# Altium project Engineering_project_main_board.PrjPcb (part 1 of 2)
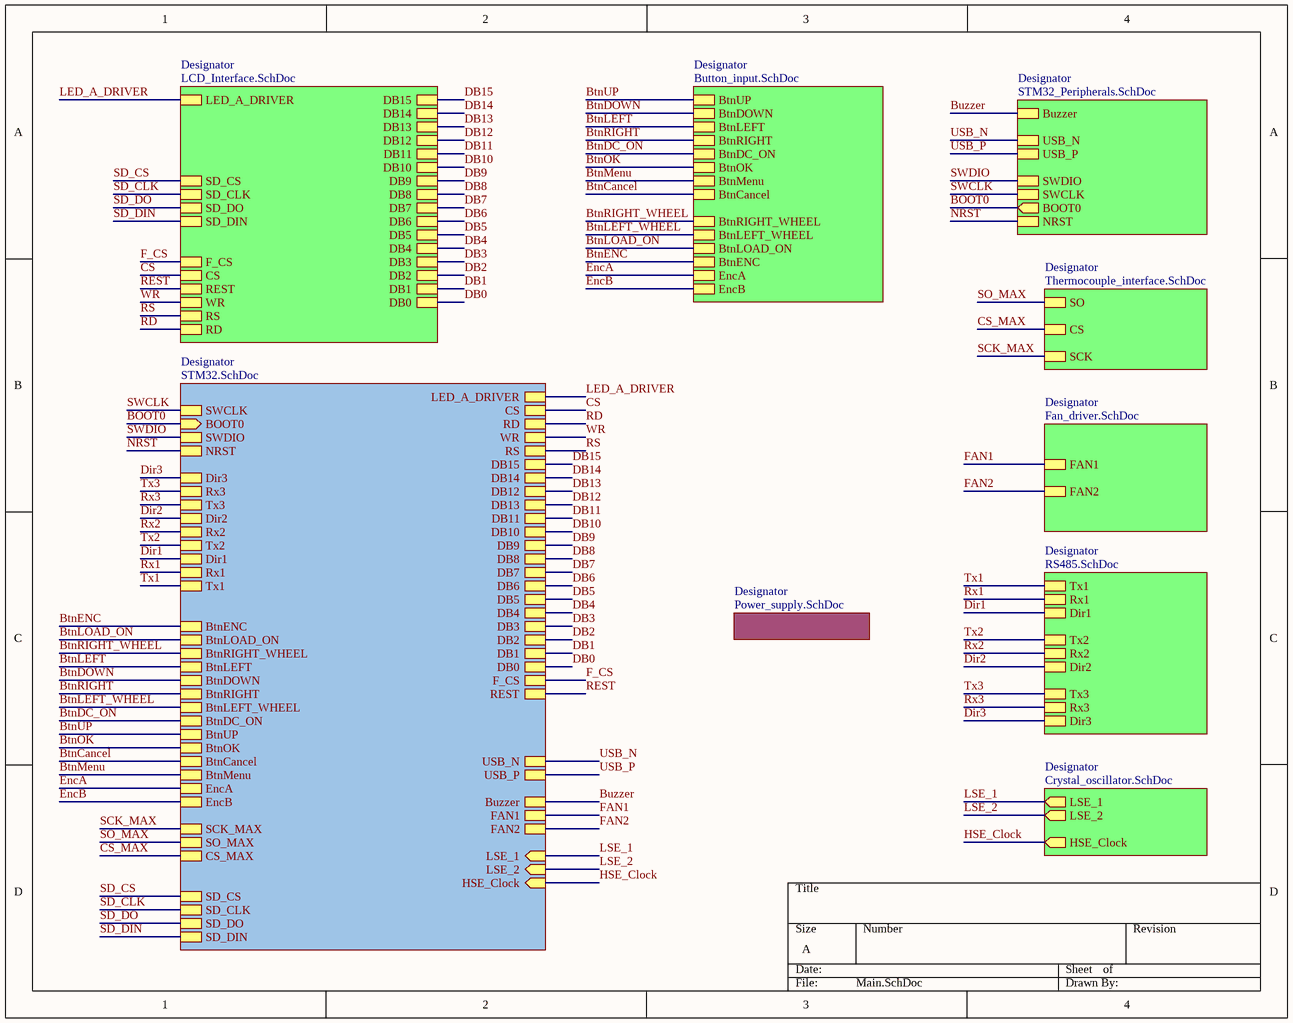
[diagram p0: Main.SchDoc]
10 sheets, 118 parts. Net scope: hierarchical (ports join the sheet entries above them; power ports are global).
Board file: PCB.PcbDoc
Sheets:
  Main.SchDoc
    Designator = Thermocouple_interface.SchDoc
    Designator = Fan_driver.SchDoc
    Designator = RS485.SchDoc
    Designator = Button_input.SchDoc
    Designator = Crystal_oscillator.SchDoc
    Designator = LCD_Interface.SchDoc
    Designator = STM32_Peripherals.SchDoc
    Designator = STM32.SchDoc
    Designator = Power_supply.SchDoc

## Sheet Main.SchDoc
size A; SheetNumber: 1; SheetTotal: 10

### Sub-sheets
Designator = Thermocouple_interface.SchDoc: SO, CS, SCK
Designator = Fan_driver.SchDoc: FAN1, FAN2
Designator = RS485.SchDoc: Tx1, Rx1, Dir1, Tx2, Rx2, Dir2, Tx3, Rx3, Dir3
Designator = Button_input.SchDoc: BtnUP, BtnDOWN, BtnLEFT, BtnRIGHT, BtnDC_ON, BtnOK, BtnRIGHT_WHEEL, BtnLEFT_WHEEL, BtnLOAD_ON, BtnENC, EncA, EncB, BtnMenu, BtnCancel
Designator = Crystal_oscillator.SchDoc: LSE_1 (out), LSE_2 (out), HSE_Clock (out)
Designator = LCD_Interface.SchDoc: SD_CLK, SD_DO, SD_DIN, SD_CS, LED_A_DRIVER, F_CS, CS, WR, REST, RS, RD, DB15, DB14, DB13, DB12, DB11, DB10, DB9, DB7, DB8, DB6, DB5, DB4, DB3, DB2, DB1, DB0
Designator = STM32_Peripherals.SchDoc: Buzzer, USB_N, USB_P, SWDIO, SWCLK, BOOT0 (out), NRST
Designator = STM32.SchDoc: SWCLK, SWDIO, BOOT0 (in), NRST, Buzzer, USB_N, USB_P, BtnENC, BtnLOAD_ON, BtnRIGHT_WHEEL, EncA, BtnMenu, BtnCancel, EncB, BtnLEFT, BtnDOWN, BtnUP, BtnRIGHT, BtnLEFT_WHEEL, BtnDC_ON, BtnOK, FAN1, FAN2, SO_MAX, SCK_MAX, HSE_Clock (in), LSE_2 (in), LSE_1 (in), LED_A_DRIVER, SD_CS, SD_CLK, SD_DO, SD_DIN, REST, F_CS, RD, WR, RS, DB15, DB14, DB13, DB12, DB11, DB10, DB9, DB8, DB7, DB5, DB6, DB4, DB3, DB2, DB1, DB0, CS, Tx1, Rx1, Dir1, Tx2, Rx2, Dir2, Tx3, Rx3, Dir3, CS_MAX
Designator = Power_supply.SchDoc: no entries

### Nets
BOOT0: sheet Designator/BOOT0, sheet Designator/BOOT0
BtnCancel: sheet Designator/BtnCancel, sheet Designator/BtnCancel
BtnDC_ON: sheet Designator/BtnDC_ON, sheet Designator/BtnDC_ON
BtnDOWN: sheet Designator/BtnDOWN, sheet Designator/BtnDOWN
BtnENC: sheet Designator/BtnENC, sheet Designator/BtnENC
BtnLEFT: sheet Designator/BtnLEFT, sheet Designator/BtnLEFT
BtnLEFT_WHEEL: sheet Designator/BtnLEFT_WHEEL, sheet Designator/BtnLEFT_WHEEL
BtnLOAD_ON: sheet Designator/BtnLOAD_ON, sheet Designator/BtnLOAD_ON
BtnMenu: sheet Designator/BtnMenu, sheet Designator/BtnMenu
BtnOK: sheet Designator/BtnOK, sheet Designator/BtnOK
BtnRIGHT: sheet Designator/BtnRIGHT, sheet Designator/BtnRIGHT
BtnRIGHT_WHEEL: sheet Designator/BtnRIGHT_WHEEL, sheet Designator/BtnRIGHT_WHEEL
BtnUP: sheet Designator/BtnUP, sheet Designator/BtnUP
Buzzer: sheet Designator/Buzzer, sheet Designator/Buzzer
CS: sheet Designator/CS, sheet Designator/CS
CS_MAX: sheet Designator/CS, sheet Designator/CS_MAX
DB0: sheet Designator/DB0, sheet Designator/DB0
DB1: sheet Designator/DB1, sheet Designator/DB1
DB2: sheet Designator/DB2, sheet Designator/DB2
DB3: sheet Designator/DB3, sheet Designator/DB3
DB4: sheet Designator/DB4, sheet Designator/DB4
DB5: sheet Designator/DB5, sheet Designator/DB5
DB6: sheet Designator/DB6, sheet Designator/DB6
DB7: sheet Designator/DB7, sheet Designator/DB7
DB8: sheet Designator/DB8, sheet Designator/DB8
DB9: sheet Designator/DB9, sheet Designator/DB9
DB10: sheet Designator/DB10, sheet Designator/DB10
DB11: sheet Designator/DB11, sheet Designator/DB11
DB12: sheet Designator/DB12, sheet Designator/DB13
DB13: sheet Designator/DB13, sheet Designator/DB12
DB14: sheet Designator/DB14, sheet Designator/DB14
DB15: sheet Designator/DB15, sheet Designator/DB15
Dir1: sheet Designator/Dir1, sheet Designator/Dir1
Dir2: sheet Designator/Dir2, sheet Designator/Dir2
Dir3: sheet Designator/Dir3, sheet Designator/Dir3
EncA: sheet Designator/EncA, sheet Designator/EncA
EncB: sheet Designator/EncB, sheet Designator/EncB
F_CS: sheet Designator/F_CS, sheet Designator/F_CS
FAN1: sheet Designator/FAN1, sheet Designator/FAN1
FAN2: sheet Designator/FAN2, sheet Designator/FAN2
HSE_Clock: sheet Designator/HSE_Clock, sheet Designator/HSE_Clock
LED_A_DRIVER: sheet Designator/LED_A_DRIVER, sheet Designator/LED_A_DRIVER
LSE_1: sheet Designator/LSE_1, sheet Designator/LSE_1
LSE_2: sheet Designator/LSE_2, sheet Designator/LSE_2
NRST: sheet Designator/NRST, sheet Designator/NRST
RD: sheet Designator/RD, sheet Designator/RD
REST: sheet Designator/REST, sheet Designator/REST
RS: sheet Designator/RS, sheet Designator/RS
Rx1: sheet Designator/Rx1, sheet Designator/Rx1
Rx2: sheet Designator/Rx2, sheet Designator/Rx2
Rx3: sheet Designator/Rx3, sheet Designator/Tx3
SCK_MAX: sheet Designator/SCK, sheet Designator/SCK_MAX
SD_CLK: sheet Designator/SD_CLK, sheet Designator/SD_CLK
SD_CS: sheet Designator/SD_CS, sheet Designator/SD_CS
SD_DIN: sheet Designator/SD_DIN, sheet Designator/SD_DIN
SD_DO: sheet Designator/SD_DO, sheet Designator/SD_DO
SO_MAX: sheet Designator/SO, sheet Designator/SO_MAX
SWCLK: sheet Designator/SWCLK, sheet Designator/SWCLK
SWDIO: sheet Designator/SWDIO, sheet Designator/SWDIO
Tx1: sheet Designator/Tx1, sheet Designator/Tx1
Tx2: sheet Designator/Tx2, sheet Designator/Tx2
Tx3: sheet Designator/Tx3, sheet Designator/Rx3
USB_N: sheet Designator/USB_N, sheet Designator/USB_N
USB_P: sheet Designator/USB_P, sheet Designator/USB_P
WR: sheet Designator/WR, sheet Designator/WR

## Sheet Thermocouple_interface.SchDoc
size A; SheetNumber: 2; SheetTotal: 10
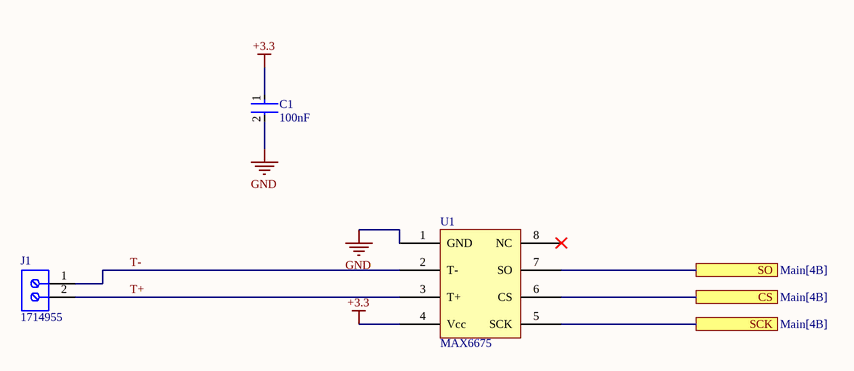
[diagram p1: Thermocouple_interface.SchDoc]

### Parts
C1  100nF  [FP-0805-L_2_01_0_2-W_1_25-IPC_B]
J1  1714955  [PHOE-1714955_V]
U1  MAX6675  [SO08]

### Ports
CS (see Main[4B]), SCK (see Main[4B]), SO (see Main[4B])

### Nets
+3.3: C1.1 U1.4(Vcc)
GND: C1.2 U1.1(GND)
CS_MAX: U1.6(CS) ; port CS
SCK_MAX: U1.5(SCK) ; port SCK
SO_MAX: U1.7(SO) ; port SO
T+: J1.2 U1.3(T+)
T-: J1.1 U1.2(T-)

Not connected (* = marked no-connect by the designer): U1 8(NC)*

### Library data of the parts
C1 = CMP-2007-04174-2: General Purpose Ceramic Capacitor, 0805, 100nF, 10%, X7R, 15%, 100V; Packaging: Tape and Reel; Min Operating Temperature: -55°C; Dielectric Material: Ceramic; Height: 1.4mm; Voltage Rating: 100V; Termination: SMD/SMT; Case Code (Imperial): 0805; Case Code (Metric): 2012; Case/Package: 0805; Construction: Flat; Radiation Hardening: No; Series: -; Dielectric: X7R; Package Quantity: 2000; Mount: Surface Mount; Capacitance: 100nF; Contact Plating: Tin; Voltage: 100V; Lead Free: Lead Free; Depth: 1.25mm; RoHS Compliant: Yes; Number of Pins: 2; Max Operating Temperature: 125°C; Length: 2.01mm; Voltage Rating (DC): 100V; Thickness: 0.055inch; REACH SVHC: No SVHC; Width: 0.049inch; Tolerance: 10%
J1 = CMP-2000-05797-1: PC Terminal Block, Pitch 6.35 mm, 1 x 2 Position, Height 21.5 mm, Tail Lenght 5.1 mm, RoHS, Bulk; Manufacturer: Phoenix Contact; Package Description: PC Terminal Block, Pitch 6.35 mm, 1 x 2 Position, Height 21.5 mm, Tail Lenght 5.1 mm; Datasheet URL: http://media.digikey.com/pdf/Data%20Sheets/Phoenix%20Contact%20PDFs/1714955.pdf; Package Reference: 1714955; Manufacturer URL: http://www.phoenixcontact.com/; Datasheet Version: 02/2010; Mounting Technology: ThroughHole

## Sheet Fan_driver.SchDoc
size A; SheetNumber: 3; SheetTotal: 10
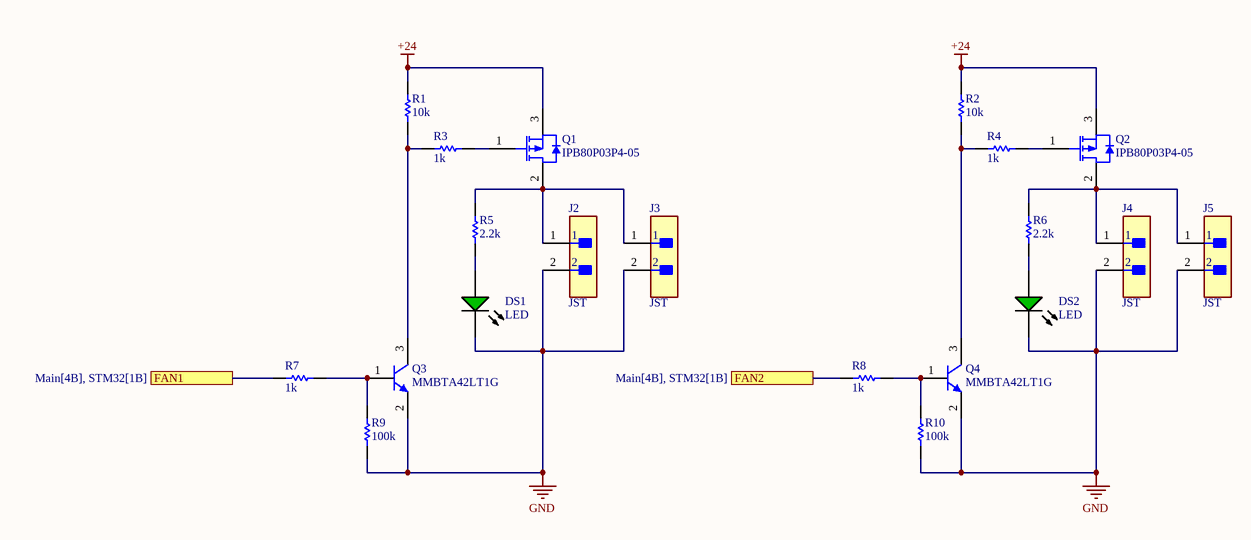
[diagram p2: Fan_driver.SchDoc]

### Parts
DS1  LED  [AVAG-HSMX-C170_V]
DS2  LED  [AVAG-HSMX-C170_V]
J2  JST  [FP-B2B-EH-A_LF_SN-MFG]
J3  JST  [FP-B2B-EH-A_LF_SN-MFG]
J4  JST  [FP-B2B-EH-A_LF_SN-MFG]
J5  JST  [FP-B2B-EH-A_LF_SN-MFG]
Q1  IPB80P03P4-05  [INF-PG-TO263-3-2_N]
Q2  IPB80P03P4-05  [INF-PG-TO263-3-2_N]
Q3  MMBTA42LT1G  [ONSC-SOT-23-3-318-08_V]
Q4  MMBTA42LT1G  [ONSC-SOT-23-3-318-08_V]
R1  10k  [RESC2013X50X30LL20T20]
R2  10k  [RESC2013X50X30LL20T20]
R3  1k  [RESC2013X50X30LL20T20]
R4  1k  [RESC2013X50X30LL20T20]
R5  2.2k  [RESC2013X50X30LL20T20]
R6  2.2k  [RESC2013X50X30LL20T20]
R7  1k  [RESC2013X50X30LL20T20]
R8  1k  [RESC2013X50X30LL20T20]
R9  100k  [RESC2013X50X30LL20T20]
R10  100k  [RESC2013X50X30LL20T20]

### Ports
FAN1 (see Main[4B], STM32[1B]), FAN2 (see Main[4B], STM32[1B])

### Nets
+24: Q1.3(SOURCE) Q2.3(SOURCE) R1.2 R2.2
GND: DS1.2(K) DS2.2(K) J2.2 J3.2 J4.2 J5.2 Q3.2(E) Q4.2(E) R9.1 R10.1
FAN1: R7.1 ; port FAN1
FAN2: R8.1 ; port FAN2
NetDS1_1: DS1.1(A) R5.1
NetDS2_1: DS2.1(A) R6.1
NetJ2_1: J2.1 J3.1 Q1.2(DRAIN) R5.2
NetJ4_1: J4.1 J5.1 Q2.2(DRAIN) R6.2
NetQ1_1: Q1.1(GATE) R3.2
NetQ2_1: Q2.1(GATE) R4.2
NetQ3_1: Q3.1(B) R7.2 R9.2
NetQ3_3: Q3.3(C) R1.1 R3.1
NetQ4_1: Q4.1(B) R8.2 R10.2
NetQ4_3: Q4.3(C) R2.1 R4.1

### Library data of the parts
DS1 DS2 = CMP-2000-05062-1: Chip LED, Green, 2.2 V, -40 to 85 degC, 2-Pin SMD, Pb-Free, Tape and Reel; Manufacturer: Avago; No. of Pins: 2; Peak Wavelength: 570nm; SVHC: NoSVHC(16-Jun-2014); Dominant Wavelength: 572nm; Forward Current If: 20mA; Viewing Angle: 170deg; Lens Shape: Rectangular; PIV Max: 5V; External Width: 1.25mm; LED Type: Standard; External Depth: 0.8mm; Opto Mounting Orientation: Top; Luminous Intensity: 15mcd; Luminous Intensity Min: 4mcd; Forward Voltage VF Max: 2.6V; External Length / Height: 2mm; Bulb Size: 1.25mmx1.4mm; Light Area Height: 1mm; Voltage Vf Typ: 2.2V; Operating Temperature Max: 85degC; Datasheet Version: Oct-08; MSL: MSL2A-4weeks; Peak Forward Current: 20mA; Package Description: 2-Pin Surface Mount Device, Body 2 x 1.25 mm, Height 0.8 mm; Datasheet URL: https://datasheet.ciiva.com/29280/180495-da-01-en-chip-led-hsmg-c170-gelb-gruen-29280971.pdf; Storage Temperature Min: -40degC; LED Colour: Green; Wavelength Typ: 570nm; Mounting Type: SMD; Forward Current If Max: 20mA; Dominant Wavelength Typ: 572nm; LED Mounting: SMD; Operating Temperature Range: -30degCto+85degC; Operating Temperature Min: -30degC; Manufacturer URL: http://www.avagotech.com/; Packaging: CutTape; Luminous Intensity Typ: 15mcd; Package Reference: HSMX-C170; Storage Temperature Max: 85degC; Opto Case Style: SMD; Forward Voltage: 2.2V
J2-J5 = CMP-17439-000026-1: CONN HEADER VERT 2POS 2.5MM; Number of Contacts: 2; Current Rating: 3A; Connector Type: Plug; Contact Resistance: 20mR; Gender: Male; Voltage Rating: 250V; Fastening Type: Detent; Depth: 3.8mm; Max Operating Temperature: 85°C; Orientation: Straight; Series: EH; Contact Plating: Tin; Min Operating Temperature: -25°C; Contact Type: Male Pin; Housing Color: White; Termination: Press-Fit; Housing Material: Nylon; Pitch: 2.5mm; Number of Positions: 2; Max Current Rating: 3A; Packaging: Bulk; Lead Free: Lead Free; Number of Rows: 1; Length: 7.5mm; Contact Mating Length: 0.13inch; Color: Natural; Max Voltage Rating (AC): 250V; Contact Material: Copper Alloy; Mount: Through Hole
Q1 Q2 = CMP-1138-00228-1: OptiMOS-P2 Power-Transistor, -30 V VDS, -80 A ID, PG-TO263-3-2, Reel, Green; Manufacturer: Infineon; Green: TRUE; RthJC (max): 1.1 K/W; RDS (on) (max) (@10V): 4.7 mOhm; VGS(th) (max): -4 V; QG: 100 nC; ID (max): -80 A; IDpuls (max): -320 A; VDS (max): -30 V; Ptot (max): 137 W; VGS(th) (min): -2 V; DatasheetVersion: Rev. 1.0; PackageReference: PG-TO263-3-2; ComponentLink1Description: Manufacturer URL; Mounting Technology: Surface Mount; PackageDescription: 3-Pin Plastic (Green) Transistor Single Outline Package, 10 x 9.25 mm Body, 2.54 mm Pitch; ComponentLink2URL: http://www.infineon.com/dgdl/IPP_B_I80P03P4-05_DS_10.pdf?folderId=db3a304314dca3890114ef902baa05f9&fileId=db3a30431ddc9372011e07ef59f52807&location=en.Products.Automotive_ICs.Automotive_MOSFETs.Single__P-Channel_30V_MOSFETs.DATASHEET.IPP_B_I80P03P4-05_DS_1; ComponentLink3Description: Package Specification; ComponentLink2Description: Datasheet; ComponentLink3URL: http://www.infineon.com/dgdl/BTS141TC_DS_10.pdf?folderId=db3a3043163797a6011667aa084c0e01&fileId=db3a3043242ebc9e01242f43f58b003e&location=en.Products.Automotive_ICs.Smart_High-_and_Low-Side_Switches.HITFET___TEMPFET__-_Smart_Low-Side_Switches.DATASHEET.BT; Halogen-free: TRUE; Technology: OptiMOS-P2; Packing: Reel; PartNumber: IPB80P03P4-05; ComponentLink1URL: http://www.infineon.com/; PackageVersion: Jul-09
Q3 Q4 = CMP-1048-00662-1: High Voltage Transistor, NPN Silicon, 3-Pin SOT-23, Pb-Free, Tape and Reel; Manufacturer: On Semiconductor; fT Min (MHz): 50; IC Continuous (A): 0.5; ComponentLink1URL: http://www.onsemi.com/; ComponentLink3URL: http://www.onsemi.cn/pub_link/Collateral/318-08.PDF; RoHS: TRUE; ComponentLink2Description: Datasheet; PartNumber: MMBTA42LT1G; Polarity: NPN; DatasheetVersion: Rev. 12; PackageReference: SOT-23-3-318-08; PackageDescription: 3-Pin Small Outline Transistor, Body 2.92 x 1.3 mm, Pitch 0.95 mm; ComponentLink3Description: Package Specification; ComponentLink1Description: Manufacturer URL; Packing: Tape and Reel; PackageVersion: Rev. AP, 11/2009; Mounting Technology: Surface Mount; ComponentLink2URL: http://www.onsemi.cn/pub_link/Collateral/MMBTA42LT1-D.PDF
R1-R10 = CMP-2001-04896-1: Manufacturer: Vishay Dale; Part Number: CRCW08050000Z0EA

## Sheet RS485.SchDoc
size A; SheetNumber: 9; SheetTotal: 10
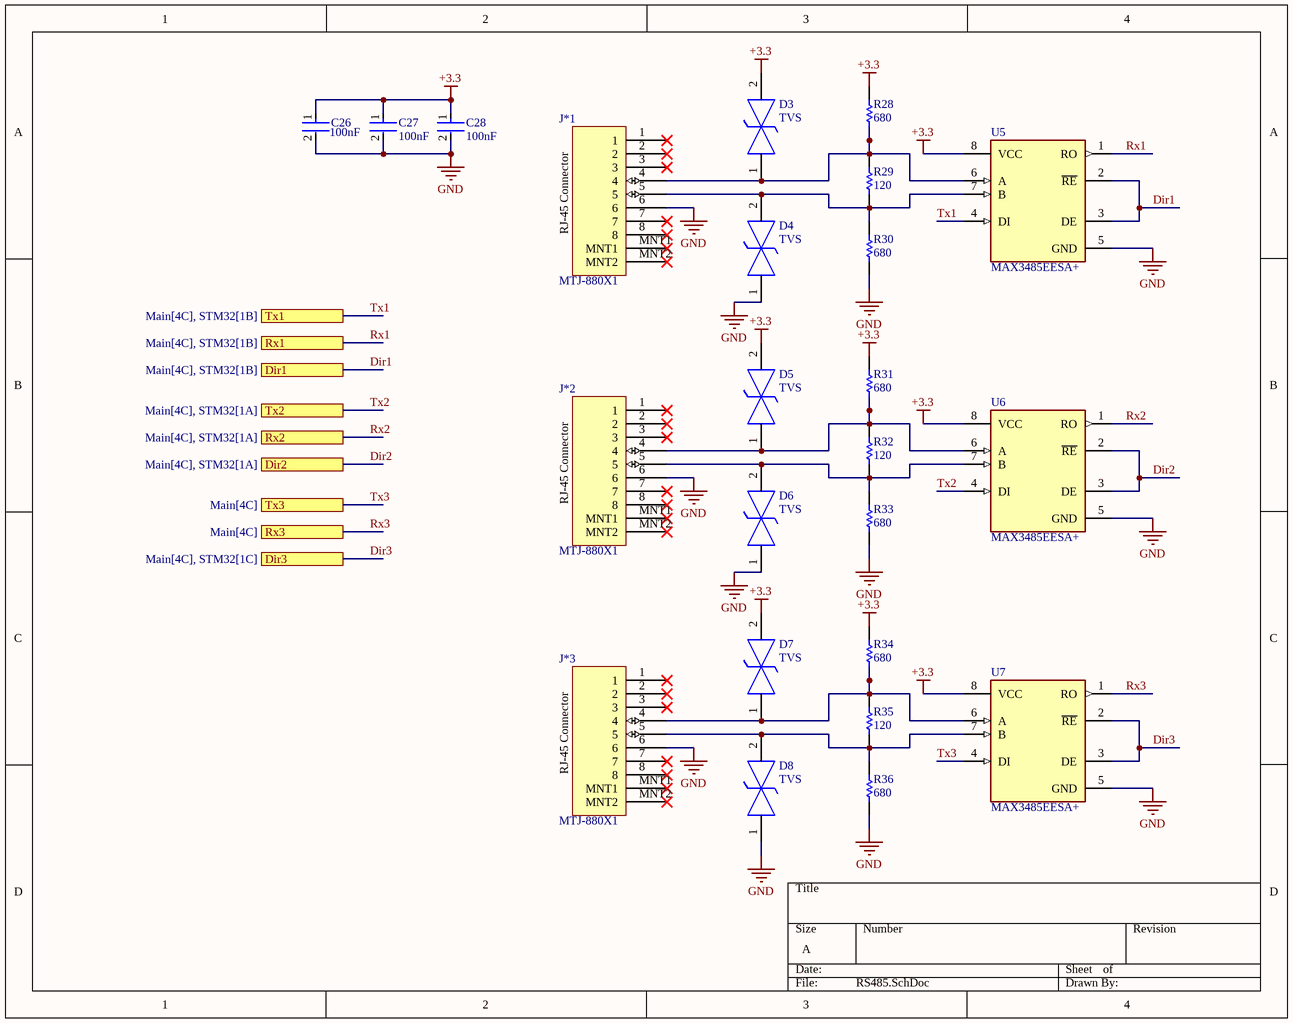
[diagram p3: RS485.SchDoc]

### Parts
C26  100nF  [FP-0805-L_2_01_0_2-W_1_25-IPC_B]
C27  100nF  [FP-0805-L_2_01_0_2-W_1_25-IPC_B]
C28  100nF  [FP-0805-L_2_01_0_2-W_1_25-IPC_B]
D3  TVS  [FP-SMB-MFG]
D4  TVS  [FP-SMB-MFG]
D5  TVS  [FP-SMB-MFG]
D6  TVS  [FP-SMB-MFG]
D7  TVS  [FP-SMB-MFG]
D8  TVS  [FP-SMB-MFG]
J*1  MTJ-880X1  [MTJ-880X1]
J*2  MTJ-880X1  [MTJ-880X1]
J*3  MTJ-880X1  [MTJ-880X1]
R28  680  [RESC2013X50X30LL20T20]
R29  120  [RESC2013X50X30LL20T20]
R30  680  [RESC2013X50X30LL20T20]
R31  680  [RESC2013X50X30LL20T20]
R32  120  [RESC2013X50X30LL20T20]
R33  680  [RESC2013X50X30LL20T20]
R34  680  [RESC2013X50X30LL20T20]
R35  120  [RESC2013X50X30LL20T20]
R36  680  [RESC2013X50X30LL20T20]
U5  MAX3485EESA+  [FP-S8-5-MFG]
U6  MAX3485EESA+  [FP-S8-5-MFG]
U7  MAX3485EESA+  [FP-S8-5-MFG]

### Ports
Dir1 (see Main[4C], STM32[1B]), Dir2 (see Main[4C], STM32[1A]), Dir3 (see Main[4C], STM32[1C]), Rx1 (see Main[4C], STM32[1B]), Rx2 (see Main[4C], STM32[1A]), Rx3 (see Main[4C]), Tx1 (see Main[4C], STM32[1B]), Tx2 (see Main[4C], STM32[1A]), Tx3 (see Main[4C])

### Nets
+3.3: C26.1 C27.1 C28.1 D3.2 D5.2 D7.2 R28.2 R31.2 R34.2 U5.8(VCC) U6.8(VCC) U7.8(VCC)
GND: C26.2 C27.2 C28.2 D4.1 D6.1 D8.1 J*1.6 J*2.6 J*3.6 R30.1 R33.1 R36.1 U5.5(GND) U6.5(GND) U7.5(GND)
Dir1: U5.2(~{RE}) U5.3(DE) ; port Dir1
Dir2: U6.2(~{RE}) U6.3(DE) ; port Dir2
Dir3: U7.2(~{RE}) U7.3(DE) ; port Dir3
Rx1: U5.1(RO) ; port Rx1
Rx2: U6.1(RO) ; port Rx2
Rx3: U7.1(RO) ; port Rx3
Tx1: U5.4(DI) ; port Tx1
Tx2: U6.4(DI) ; port Tx2
Tx3: U7.4(DI) ; port Tx3
NetD3_1: D3.1 J*1.4 R28.1 R29.2 U5.6(A)
NetD4_2: D4.2 J*1.5 R29.1 R30.2 U5.7(B)
NetD5_1: D5.1 J*2.4 R31.1 R32.2 U6.6(A)
NetD6_2: D6.2 J*2.5 R32.1 R33.2 U6.7(B)
NetD7_1: D7.1 J*3.4 R34.1 R35.2 U7.6(A)
NetD8_2: D8.2 J*3.5 R35.1 R36.2 U7.7(B)

Not connected (* = marked no-connect by the designer): J*1 1* 2* 3* 7* 8* MNT1* MNT2*; J*2 1* 2* 3* 7* 8* MNT1* MNT2*; J*3 1* 2* 3* 7* 8* MNT1* MNT2*

### Notes on the sheet
- (in symbol MTJ-880X1) RJ-45 Connector

### Library data of the parts
C26-C28 = CMP-2007-04174-2: as C1 on sheet Thermocouple_interface; Packaging: Tape and Reel; Min Operating Temperature: -55°C; Dielectric Material: Ceramic; Height: 1.4mm; Voltage Rating: 100V; Termination: SMD/SMT; Case Code (Imperial): 0805; Case Code (Metric): 2012; Case/Package: 0805; Construction: Flat; Radiation Hardening: No; Series: -; Dielectric: X7R; Package Quantity: 2000; Mount: Surface Mount; Capacitance: 100nF; Contact Plating: Tin; Voltage: 100V; Lead Free: Lead Free; Depth: 1.25mm; RoHS Compliant: Yes; Number of Pins: 2; Max Operating Temperature: 125°C; Length: 2.01mm; Voltage Rating (DC): 100V; Thickness: 0.055inch; REACH SVHC: No SVHC; Width: 0.049inch; Tolerance: 10%
D3-D8 = CMP-12225-000039-1: TVS DIODE 28.2V 59V SMB; Manufacturer Part Number: SM6T33CA; Manufacturer: STMicroelectronics; Max Junction Temp: +150°C; Standoff Height: 0.05mm; Direction: Bidirectional; Number Of Channels: 1; Reverse Standoff Voltage: 33V; Peak Pulse Current: 68A; Breakdown Voltage: 31.4V; Peak Pulse Power: 600W; Mouser Description: TVS Diodes - Transient Voltage Suppressors 600W 33V Bidirect; Device Class L1: Circuit Protection; Device Class L3: unset; Temperature Range Low: -55°C; Octopart: https://octopart.com/sm6t33ca-stmicroelectronics-55399331; Height: 2.65mm; Digikey Description: TVS DIODE 28.2V 59V SMB; Automotive: No; Category: Diode; Device Class L2: TVS Diodes; Temperature: -55°C to +150°C; ComponentLink2URL: https://www.st.com/resource/en/datasheet/sm6t.pdf; Lead Free: Yes; Clamping Voltage: 59V; RoHS: TRUE; Temperature Range High: +150°C; Package: SMB; ComponentLink2Description: Datasheet
R28-R36 = CMP-2001-04896-1: as R1 on sheet Fan_driver
U5-U7 = CMP-05679-000038-1: IC TXRX RS485/422 10MBPS 8SOIC; Manufacturer: Maxim Integrated; Number Of Receivers: 1; Simplex Duplex: Half Duplex; Data Rate: 15Mbits/s; Interface: RS-485,RS-422; Max Supply Voltage: 3.6V; Nominal Supply Current: 0.95-1.1mA; Min Supply Voltage: 3V; Standoff Height: 0.1mm; Mouser Description: RS-422/RS-485 Interface IC 3.3V 12Mbps Transceiver; Lead Free: Yes; Footprint Url: https://pdfserv.maximintegrated.com/land_patterns/90-0096.PDF; Device Class L1: Integrated Circuits (ICs); Device Class L3: RS-232 / RS-422 / RS-485 Interface ICs; RoHS: TRUE; Height: 1.75mm; ComponentLink2URL: https://datasheets.maximintegrated.com/en/ds/MAX3483E-MAX3491E.pdf; Temperature Range High: +85°C; Temperature: -40°C to +85°C; Manufacturer Part Number: MAX3485EESA+; Number Of Transmitters: 1; Device Class L2: Interface ICs; Octopart: https://octopart.com/max3485eesa%2B-maxim+integrated-39731903; ComponentLink2Description: Datasheet; Category: IC; Digikey Description: IC TXRX RS485/422 10MBPS 8SOIC; Automotive: No; Temperature Range Low: -40°C; Package: S8-5

## Sheet Button_input.SchDoc
size A; SheetNumber: 6; SheetTotal: 10
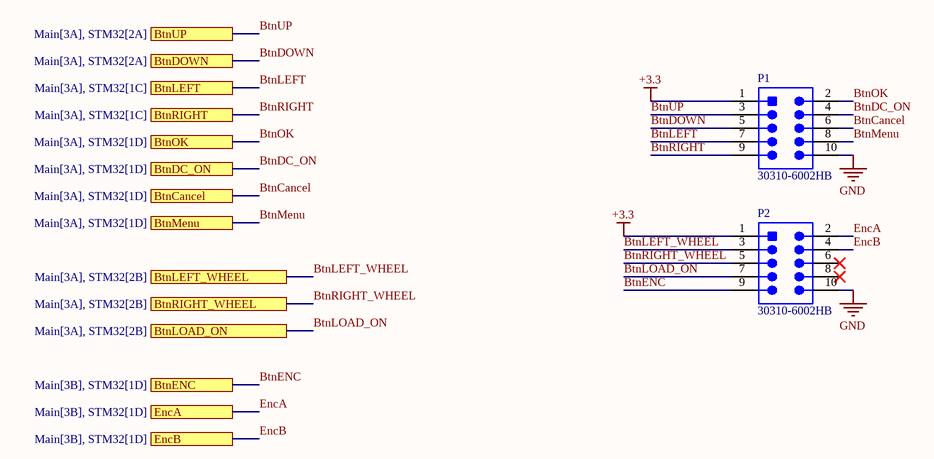
[diagram p4: Button_input.SchDoc]

### Parts
P1  30310-6002HB  [3M-30310-6002HB-10_V]
P2  30310-6002HB  [3M-30310-6002HB-10_V]

### Ports
BtnCancel (see Main[3A], STM32[1D]), BtnDC_ON (see Main[3A], STM32[1D]), BtnDOWN (see Main[3A], STM32[2A]), BtnENC (see Main[3B], STM32[1D]), BtnLEFT (see Main[3A], STM32[1C]), BtnLEFT_WHEEL (see Main[3A], STM32[2B]), BtnLOAD_ON (see Main[3A], STM32[2B]), BtnMenu (see Main[3A], STM32[1D]), BtnOK (see Main[3A], STM32[1D]), BtnRIGHT (see Main[3A], STM32[1C]), BtnRIGHT_WHEEL (see Main[3A], STM32[2B]), BtnUP (see Main[3A], STM32[2A]), EncA (see Main[3B], STM32[1D]), EncB (see Main[3B], STM32[1D])

### Nets
+3.3: P1.1 P2.1
GND: P1.10 P2.10
BtnCancel: P1.6 ; port BtnCancel
BtnDC_ON: P1.4 ; port BtnDC_ON
BtnDOWN: P1.5 ; port BtnDOWN
BtnENC: P2.9 ; port BtnENC
BtnLEFT: P1.7 ; port BtnLEFT
BtnLEFT_WHEEL: P2.3 ; port BtnLEFT_WHEEL
BtnLOAD_ON: P2.7 ; port BtnLOAD_ON
BtnMenu: P1.8 ; port BtnMenu
BtnOK: P1.2 ; port BtnOK
BtnRIGHT: P1.9 ; port BtnRIGHT
BtnRIGHT_WHEEL: P2.5 ; port BtnRIGHT_WHEEL
BtnUP: P1.3 ; port BtnUP
EncA: P2.2 ; port EncA
EncB: P2.4 ; port EncB

Not connected (* = marked no-connect by the designer): P2 6* 8*

### Library data of the parts
P1 P2 = CMP-2000-05031-1: Male Header, Pitch 2.54 mm, 2 x 5 Position, Height 9.3 mm, Tail Length 2.79 mm, -55 to 105 degC, RoHS, Bulk; Manufacturer: 3M; Current Rating: 1A; Brand: 3MElectronicSolutionsDivision; Mounting Angle: Straight; Number of Positions: 10Position; Mating Post Length: 5.99mm; Pitch: 2.54mm; Manufacturer URL: http://www.3m.com/; Factory Pack Quantity: 1000; Mounting Style: StraightPin; Number of Rows: 2Row; Termination Post Length: 2.79mm; Contact Gender: Pin(Male); Contact Material: Brass; Termination Style: ThroughHole; Product: Headers; Packaging: Tray; Product Category: Headers&WireHousings; Type: Shrouded; Datasheet URL: http://datasheet.octopart.com/30310-6002HB-3M-datasheet-11537585.pdf; Datasheet Version: Apr-12; Contact Plating: Gold; Row Spacing: 2.54mm; Housing Material: Polyester; Series: 303; RoHS: Details

## Sheet Crystal_oscillator.SchDoc
size A; SheetNumber: 5; SheetTotal: 10
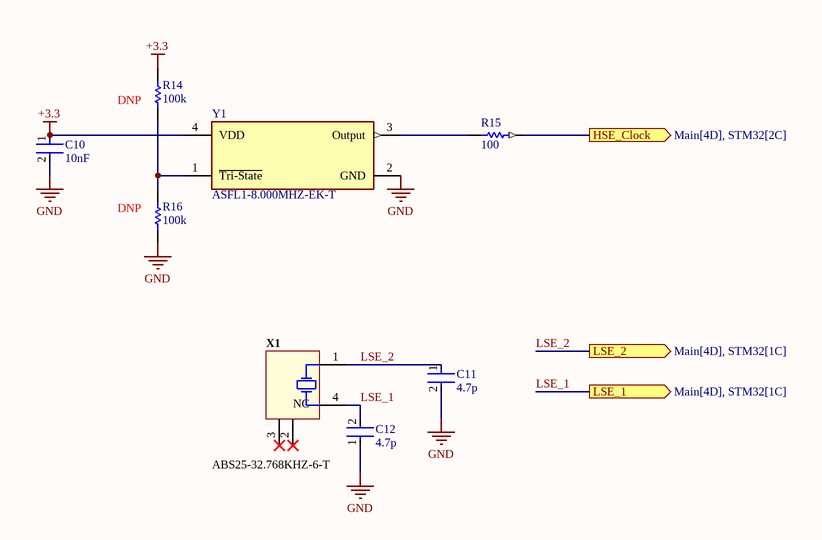
[diagram p5: Crystal_oscillator.SchDoc]

### Parts
C10  10nF  [FP-0805-L_2_01_0_2-W_1_25-IPC_B]
C11  4.7p  [FP-C0603C-CF-MFG]
C12  4.7p  [FP-C0603C-CF-MFG]
R14  100k  [RESC2013X50X30LL20T20]
R15  100  [RESC2013X50X30LL20T20]
R16  100k  [RESC2013X50X30LL20T20]
X1  ABS25-32.768KHZ-6-T  [ABRA-ABS25-4_V]
Y1  ASFL1-8.000MHZ-EK-T  [FP-ASFL1-MFG]

### Ports
HSE_Clock (out, see Main[4D], STM32[2C]), LSE_1 (out, see Main[4D], STM32[1C]), LSE_2 (out, see Main[4D], STM32[1C])

### Nets
+3.3: C10.1 R14.2 Y1.4(VDD)
GND: C10.2 C11.2 C12.1 R16.1 Y1.2(GND)
HSE_Clock: R15.2 ; port HSE_Clock
LSE_1: C12.2 X1.4(X2) ; port LSE_1
LSE_2: C11.1 X1.1(X1) ; port LSE_2
NetR14_1: R14.1 R16.2 Y1.1(~{Tri-State})
NetR15_1: R15.1 Y1.3(Output)

Not connected (* = marked no-connect by the designer): X1 2(NC)* 3(NC)*

### Notes on the sheet
- (near R14) DNP
- (near R16) DNP

### Library data of the parts
C10 = CMP-2007-04174-2: General Purpose Ceramic Capacitor, 0805, 10nF, 10%, X7R, 15%, 100V; Capacitance: 100nF; Packaging: Tape and Reel; Min Operating Temperature: -55°C; Dielectric Material: Ceramic; Height: 1.4mm; Voltage Rating: 100V; Termination: SMD/SMT; Case Code (Imperial): 0805; Case Code (Metric): 2012; Case/Package: 0805; Construction: Flat; Radiation Hardening: No; Series: -; Dielectric: X7R; Package Quantity: 2000; Mount: Surface Mount; Contact Plating: Tin; Voltage: 100V; Lead Free: Lead Free; Depth: 1.25mm; RoHS Compliant: Yes; Number of Pins: 2; Max Operating Temperature: 125°C; Length: 2.01mm; Voltage Rating (DC): 100V; Thickness: 0.055inch; REACH SVHC: No SVHC; Width: 0.049inch; Tolerance: 10%
C11 C12 = CMP-2006-03061-2: CAP CER 0.1UF 50V X7R 0603; Manufacturer: KEMET; Manufacturer Part Number: C0603C104K5RACTU; Tolerance: 0.1; Temperature Coefficient: 30ppm/°C; Material: Ceramic; Automotive Grade: Grade 1; Value: 0.10 μF; Temperature: -55°C to +125°C; RoHS: TRUE; Temperature Range High: +125°C; Lead Free: Yes; Octopart: https://octopart.com/c0603c104k5ractu-kemet-139244; Digikey Description: CAP CER 0.1UF 50V X7R 0603; Category: Cap; Package: C0603C-CF; ComponentLink2Description: Datasheet; Temperature Range Low: -55°C; Device Class L1: Passive Components; Voltage Rating: 50 V; Automotive: Yes; Device Class L3: Ceramic Capacitors; ComponentLink2URL: https://api.kemet.com/component-edge/download/datasheet/C0603C100J5GACAUTO.pdf; Capacitance: 0.10 μF; Device Class L2: Capacitors; Temperature Characteristic: X7R; Height: 0.87mm
R14-R16 = CMP-2001-04896-1: as R1 on sheet Fan_driver
X1 = CMP-2000-05036-1: Low Frequency Crystal, 32.768 KHz, 6 pF, +/- 20 ppm, -40 to 85 degC, 4-Pin SMD, RoHS, Tape and Reel; Manufacturer: Abracon; Tolerance: 20PPM; ESR: 50kOhms; Case Width: 3.8mm; Case Height: 2.5mm; Case Length: 8mm; Load Capacitance: 6pF; Operating Temperature Range: -40Cto+85C; Package Reference: ABS25; Factory Pack Quantity: 3000; Package Description: 4-Pin Surface Mount Device, Body 8 x 3.8 mm, Pitch 5.5 mm; Frequency: 32.768kHz; Termination Style: SMD/SMT; Manufacturer URL: http://www.abracon.com/; Type: LowFrequencyCrystal; Dimensions: 3.8mmWx8mmLx2.5mmH; Product Category: Crystals; Series: ABS25; RoHS: Details; Package / Case: 8mmx3.8mm; Datasheet Version: Jun-17; Brand: ABRACON; Datasheet URL: https://datasheet.ciiva.com/854/abs25-854528.pdf; Packaging: Reel; Mounting Style: SMD/SMT
Y1 = CMP-27762-013261-1: XTAL Oscillator 8MHz ±30ppm HCMOS, TTL 3.3V 4-SMD 5mm x 3.2mm; Min Supply Voltage: 2.97V; Load Capacitance: 15pF; Max Supply Voltage: 3.63V; Max Supply Current: 15mA; Radiation Hardening: No; Termination: SMD/SMT; Max Operating Temperature: 70°C; Frequency Stability: 30ppm; Series: ASFL1; Package Quantity: 1000; Mount: Surface Mount; Packaging: Tape and Reel; Length: 5mm; Case/Package: SMD/SMT; Lead Free: Lead Free; Operating Supply Voltage: 3.3V; Height: 0.051inch; Frequency: 8MHz; Number of Pins: 4; Depth: 3.2mm; Operating Frequency: 8 MHz; Width: 0.126inch; Min Operating Temperature: -20°C

## Sheet LCD_Interface.SchDoc
size A; SheetNumber: 7; SheetTotal: 10
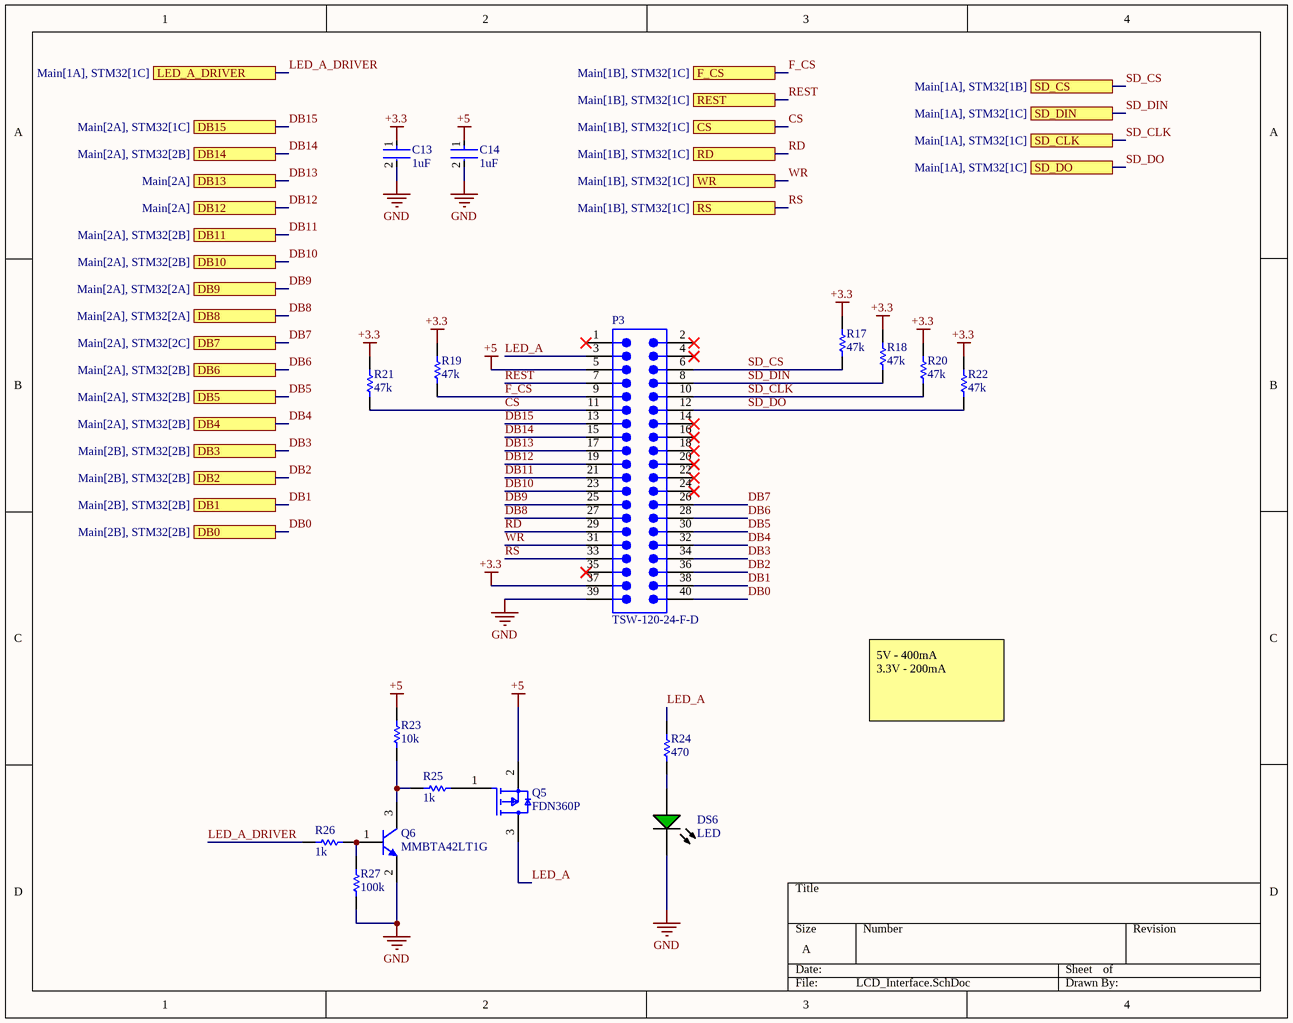
[diagram p6: LCD_Interface.SchDoc]

### Parts
C13  1uF  [FP-0805-L_2_01_0_2-W_1_25-IPC_B]
C14  1uF  [FP-0805-L_2_01_0_2-W_1_25-IPC_B]
DS6  LED  [AVAG-HSMX-C170_V]
P3  TSW-120-24-F-D  [SMTC-TSW-120-24-X-D]
Q5  FDN360P  [FP-527AG-IPC_B]
Q6  MMBTA42LT1G  [ONSC-SOT-23-3-318-08_V]
R17  47k  [RESC2013X50X30LL20T20]
R18  47k  [RESC2013X50X30LL20T20]
R19  47k  [RESC2013X50X30LL20T20]
R20  47k  [RESC2013X50X30LL20T20]
R21  47k  [RESC2013X50X30LL20T20]
R22  47k  [RESC2013X50X30LL20T20]
R23  10k  [RESC2013X50X30LL20T20]
R24  470  [RESC2013X50X30LL20T20]
R25  1k  [RESC2013X50X30LL20T20]
R26  1k  [RESC2013X50X30LL20T20]
R27  100k  [RESC2013X50X30LL20T20]

### Ports
CS (see Main[1B], STM32[1C]), DB0 (see Main[2B], STM32[2B]), DB1 (see Main[2B], STM32[2B]), DB2 (see Main[2B], STM32[2B]), DB3 (see Main[2B], STM32[2B]), DB4 (see Main[2A], STM32[2B]), DB5 (see Main[2A], STM32[2B]), DB6 (see Main[2A], STM32[2B]), DB7 (see Main[2A], STM32[2C]), DB8 (see Main[2A], STM32[2A]), DB9 (see Main[2A], STM32[2A]), DB10 (see Main[2A], STM32[2B]), DB11 (see Main[2A], STM32[2B]), DB12 (see Main[2A]), DB13 (see Main[2A]), DB14 (see Main[2A], STM32[2B]), DB15 (see Main[2A], STM32[1C]), F_CS (see Main[1B], STM32[1C]), LED_A_DRIVER (see Main[1A], STM32[1C]), RD (see Main[1B], STM32[1C]), REST (see Main[1B], STM32[1C]), RS (see Main[1B], STM32[1C]), SD_CLK (see Main[1A], STM32[1C]), SD_CS (see Main[1A], STM32[1B]), SD_DIN (see Main[1A], STM32[1C]), SD_DO (see Main[1A], STM32[1C]), WR (see Main[1B], STM32[1C])

### Nets
+3.3: C13.1 P3.37 R17.2 R18.2 R19.2 R20.2 R21.2 R22.2
+5: C14.1 P3.5 Q5.2(S) R23.2
GND: C13.2 C14.2 DS6.2(K) P3.39 Q6.2(E) R27.1
CS: P3.11 R21.1 ; port CS
DB0: P3.40 ; port DB0
DB1: P3.38 ; port DB1
DB2: P3.36 ; port DB2
DB3: P3.34 ; port DB3
DB4: P3.32 ; port DB4
DB5: P3.30 ; port DB5
DB6: P3.28 ; port DB6
DB7: P3.26 ; port DB7
DB8: P3.27 ; port DB8
DB9: P3.25 ; port DB9
DB10: P3.23 ; port DB10
DB11: P3.21 ; port DB11
DB12: P3.19 ; port DB12
DB13: P3.17 ; port DB13
DB14: P3.15 ; port DB14
DB15: P3.13 ; port DB15
F_CS: P3.9 R19.1 ; port F_CS
LED_A: P3.3 Q5.3(D) R24.2
LED_A_DRIVER: R26.1 ; port LED_A_DRIVER
RD: P3.29 ; port RD
REST: P3.7 ; port REST
RS: P3.33 ; port RS
SD_CLK: P3.10 R20.1 ; port SD_CLK
SD_CS: P3.6 R17.1 ; port SD_CS
SD_DIN: P3.8 R18.1 ; port SD_DIN
SD_DO: P3.12 R22.1 ; port SD_DO
WR: P3.31 ; port WR
NetDS6_1: DS6.1(A) R24.1
NetQ5_1: Q5.1(G) R25.2
NetQ6_1: Q6.1(B) R26.2 R27.2
NetQ6_3: Q6.3(C) R23.1 R25.1

Not connected (* = marked no-connect by the designer): P3 1* 2* 4* 14* 16* 18* 20* 22* 24* 35*

### Notes on the sheet
- 5V - 400mA
  3.3V - 200mA

### Library data of the parts
C13 C14 = CMP-2007-04174-2: as C1 on sheet Thermocouple_interface; Packaging: Tape and Reel; Min Operating Temperature: -55°C; Dielectric Material: Ceramic; Height: 1.4mm; Voltage Rating: 100V; Termination: SMD/SMT; Case Code (Imperial): 0805; Case Code (Metric): 2012; Case/Package: 0805; Construction: Flat; Radiation Hardening: No; Series: -; Dielectric: X7R; Package Quantity: 2000; Mount: Surface Mount; Capacitance: 100nF; Contact Plating: Tin; Voltage: 100V; Lead Free: Lead Free; Depth: 1.25mm; RoHS Compliant: Yes; Number of Pins: 2; Max Operating Temperature: 125°C; Length: 2.01mm; Voltage Rating (DC): 100V; Thickness: 0.055inch; REACH SVHC: No SVHC; Width: 0.049inch; Tolerance: 10%
DS6 = CMP-2000-05062-1: as DS1 on sheet Fan_driver; Operating Temperature Max: 85degC; Datasheet Version: Oct-08; MSL: MSL2A-4weeks; Peak Forward Current: 20mA; Package Description: 2-Pin Surface Mount Device, Body 2 x 1.25 mm, Height 0.8 mm; Datasheet URL: https://datasheet.ciiva.com/29280/180495-da-01-en-chip-led-hsmg-c170-gelb-gruen-29280971.pdf; Storage Temperature Min: -40degC; LED Colour: Green; Wavelength Typ: 570nm; Mounting Type: SMD; Forward Current If Max: 20mA; Dominant Wavelength Typ: 572nm; LED Mounting: SMD; Operating Temperature Range: -30degCto+85degC; Operating Temperature Min: -30degC; Manufacturer URL: http://www.avagotech.com/; Packaging: CutTape; Luminous Intensity Typ: 15mcd; Package Reference: HSMX-C170; Storage Temperature Max: 85degC; Opto Case Style: SMD; Forward Voltage: 2.2V
P3 = CMP-1024-00453-1: 0.025" SQ Post Header, Through-hole, Vertical, -55 to 125 degC, 2.54 mm Pitch, 40-Pin, Male, RoHS; Manufacturer: Samtec; Pitch: 2.54 mm; ComponentLink2Description: Datasheet; Temperature Range: -55 to 125 degC; RoHS: True; ComponentLink1Description: Manufacturer URL; PackageReference: TSW-120-24-X-D; ComponentLink1URL: http://www.samtec.com; PartNumber: TSW-120-24-F-D; ComponentLink3Description: Package Specification; DatasheetVersion: F-214; PackageDescription: .025[0.64] SQ. Post Terminal Strip Assembly; Mounting Technology: Through-hole; Orientation: Vertical; PackageVersion: DM, 8/1988; ComponentLink3URL: http://www.samtec.com/documents/webfiles/cpdf/TSW-XXX-XX-XXX-X-XX-XXX-MKT.pdf; ComponentLink2URL: http://www.samtec.com/documents/webfiles/pdf/TSW_TH.PDF
Q5 = CMP-2000-07455-3: MOSFET P-CH 30V 2A SSOT3; Gate to Source Voltage (Vgs): 20V; Turn-On Delay Time: 6ns; Number of Elements: 1; Max Power Dissipation: 500mW; Rds On Max: 80mR; Input Capacitance: 298pF; Current Rating: -2A; Dual Supply Voltage: -30V; Element Configuration: Single; Turn-Off Delay Time: 11ns; Drain to Source Resistance: 63mR; Rise Time: 13ns; REACH SVHC: No SVHC; Radiation Hardening: No; Packaging: Tape and Reel; Mount: Surface Mount; Height: 0.94mm; Power Dissipation: 500mW; Case/Package: SOT-23; Width: 1.4mm; Continuous Drain Current (ID): 2A; Lead Free: Lead Free; Package Quantity: 1; Drain to Source Voltage (Vdss): 30V; Weight: 0.03g; Voltage Rating (DC): -30V; Threshold Voltage: 20V; On-State Resistance: 80MR; Number of Pins: 3; Drain to Source Breakdown Voltage: -30V; Max Operating Temperature: 150°C; Contact Plating: Tin; Length: 2.92mm; Min Operating Temperature: -55°C; Fall Time: 6ns
Q6 = CMP-1048-00662-1: as Q3 on sheet Fan_driver; ComponentLink1URL: http://www.onsemi.com/; ComponentLink3URL: http://www.onsemi.cn/pub_link/Collateral/318-08.PDF; RoHS: TRUE; ComponentLink2Description: Datasheet; PartNumber: MMBTA42LT1G; Polarity: NPN; DatasheetVersion: Rev. 12; PackageReference: SOT-23-3-318-08; PackageDescription: 3-Pin Small Outline Transistor, Body 2.92 x 1.3 mm, Pitch 0.95 mm; ComponentLink3Description: Package Specification; ComponentLink1Description: Manufacturer URL; Packing: Tape and Reel; PackageVersion: Rev. AP, 11/2009; Mounting Technology: Surface Mount; ComponentLink2URL: http://www.onsemi.cn/pub_link/Collateral/MMBTA42LT1-D.PDF
R17-R27 = CMP-2001-04896-1: as R1 on sheet Fan_driver

## Sheet STM32_Peripherals.SchDoc
size A; SheetNumber: 10; SheetTotal: 10
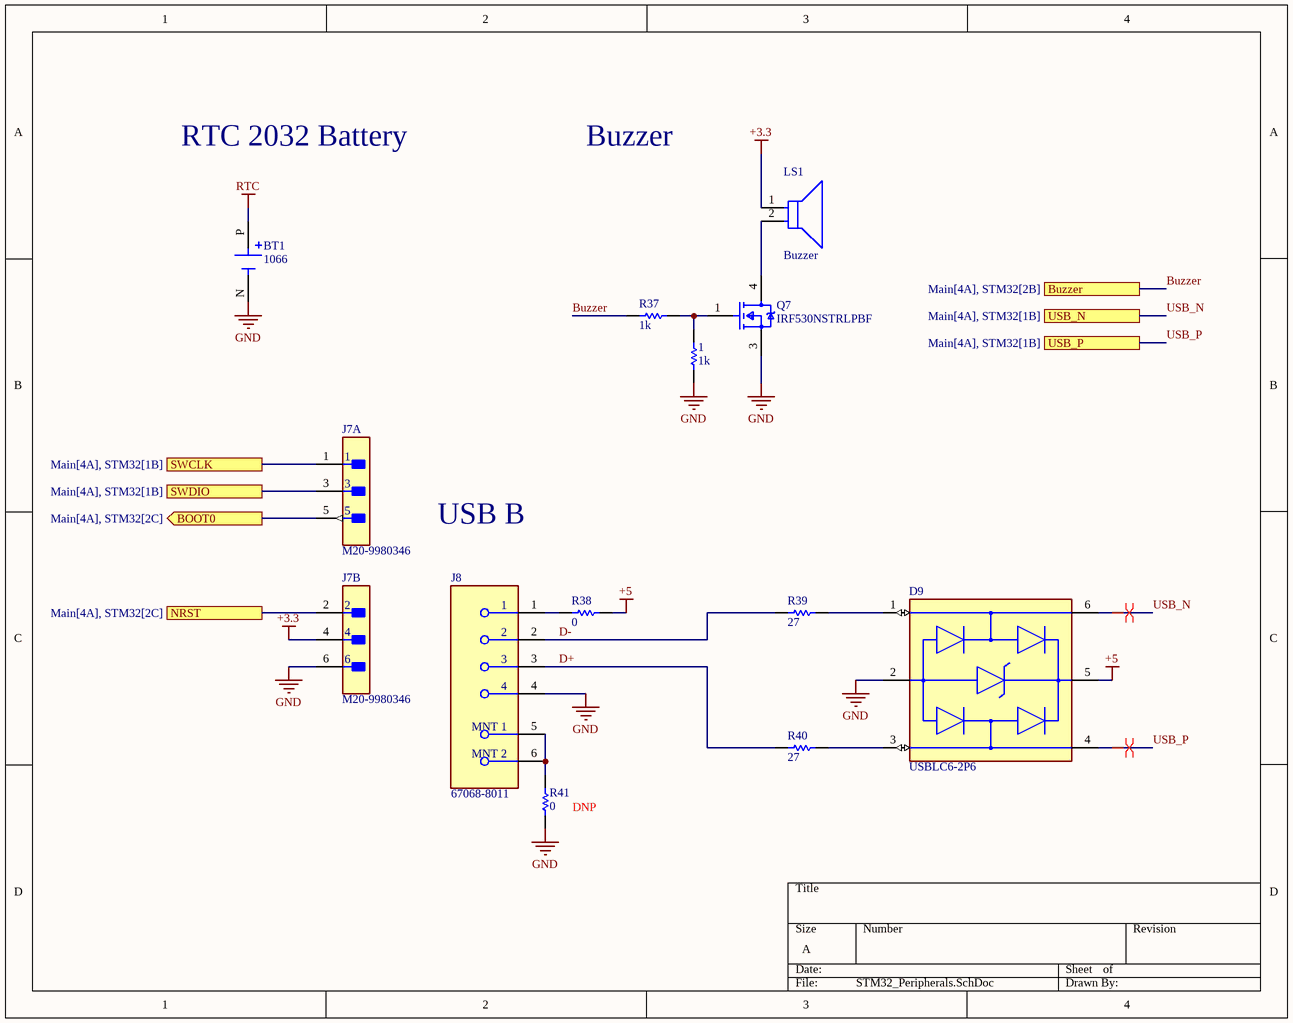
[diagram p7: STM32_Peripherals.SchDoc]

### Parts
1  1k  [RESC2013X50X30LL20T20]
BT1  1066  [BAT_1066]
D9  USBLC6-2P6  [FP-SOT-666-MFG]
J7  M20-9980346  [FP-M20-9980346-MFG]  (parts A,B of 2)
J8  67068-8011  [FP-67068-8011-MFG]
LS1  Buzzer  [FP-PKB24SPCH3601-B0-MFG]
Q7  IRF530NSTRLPBF  [FP-PG-TO263-3-MFG]
R37  1k  [RESC2013X50X30LL20T20]
R38  0  [RESC2013X50X30LL20T20]
R39  27  [RESC2013X50X30LL20T20]
R40  27  [RESC2013X50X30LL20T20]
R41  0  [RESC2013X50X30LL20T20]

### Ports
BOOT0 (out, see Main[4A], STM32[2C]), Buzzer (see Main[4A], STM32[2B]), NRST (see Main[4A], STM32[2C]), SWCLK (see Main[4A], STM32[1B]), SWDIO (see Main[4A], STM32[1B]), USB_N (see Main[4A], STM32[1B]), USB_P (see Main[4A], STM32[1B])

### Nets
+3.3: J7.4 LS1.1(C)
+5: D9.5(VBUS) R38.2
GND: 1.1 BT1.N(NEG) D9.2(GND) J7.6 J8.4 Q7.3(S) R41.1
RTC: BT1.P(POS)
BOOT0: J7.5 ; port BOOT0
Buzzer: R37.1 ; port Buzzer
D+: J8.3 R40.1
D-: J8.2 R39.1
NRST: J7.2 ; port NRST
SWCLK: J7.1 ; port SWCLK
SWDIO: J7.3 ; port SWDIO
USB_N: D9.6(I/O1) ; port USB_N
USB_P: D9.4(I/O2) ; port USB_P
Net1_2: 1.2 Q7.1(G) R37.2
NetD9_1: D9.1(I/O1) R39.2
NetD9_3: D9.3(I/O2) R40.2
NetJ8_1: J8.1 R38.1
NetJ8_5: J8.5(MNT_1) J8.6(MNT_2) R41.2
NetLS1_2: LS1.2(A) Q7.4(D)

### Layout directives
differential pair: USB_N, USB_P

### Notes on the sheet
- RTC 2032 Battery
- Buzzer
- USB B
- (near R41) DNP

### Library data of the parts
1 R37-R41 = CMP-2001-04896-1: as R1 on sheet Fan_driver
D9 = CMP-12225-000058-1: TVS DIODE 5.25V 17V SOT666; Min Breakdown Voltage: 6V; Power Line Protection: Yes; Element Configuration: Dual; Test Current: 1mA; Working Voltage: 5V; Number of Channels: 2; Max Reverse Leakage Current: 150nA; Direction: Unidirectional; Peak Pulse Current: 5A; Number of Elements: 1; Capacitance: 3.5pF; Max Breakdown Voltage: 6V; Height: 0.6mm; Depth: 1.3mm; Contact Plating: Tin; Reverse Breakdown Voltage: 6V; REACH SVHC: No SVHC; Operating Supply Voltage: 5V; Width: 1.3mm; Max Operating Temperature: 125°C; Reverse Standoff Voltage: 5V; ESD Protection: Yes; Package Quantity: 1; Termination: SMD/SMT; Length: 1.7mm; Leakage Current: 150nA; Number of Bidirectional Channels: 2; Case/Package: SOT-666; Min Operating Temperature: -40°C; Number of Pins: 6; Clamping Voltage: 17V; Breakdown Voltage: 6V; Lead Free: Lead Free; Radiation Hardening: No; Packaging: Tape and Reel; Mount: Surface Mount; Polarity: Unidirectional
J7 = CMP-2000-06636-2: CONN HEADER VERT 6POS 2.54MM; Manufacturer: Harwin; Current Rating: 3A; Number Of Contacts: 6; Conn Gender: Male; Conn Orientation: Vertical; Device Class L1: Connectors; ComponentLink2Description: Datasheet; Height: 8.99mm; Temperature Range High: +105°C; Contact Material: Tin,Nickel; RoHS: TRUE; Temperature Range Low: -40°C; ComponentLink2URL: https://cdn.harwin.com/pdfs/M20-998.pdf; Digikey Description: CONN HEADER VERT 6POS 2.54MM; Pitch: 2.54mm; Package: M20-9980346; Device Class L2: Headers and Wire Housings; Manufacturer Part Number: M20-9980346; Number Of Rows: 2; Category: Conn; Lead Free: Yes; Mouser Description: 2.54mm (0.1") Pitch DIL Vertical PC Tail Pin Header, 6.1mm mating pin height, tin, 3+3 contacts; Temperature: -40°C to +105°C; Device Class L3: unset; Octopart: https://octopart.com/m20-9980346-harwin-5436545; Automotive: No
J8 = CMP-00257-00942133-1: 67068-8011 Conn USB 2.0 Type B RCP 4 POS 2.5mm Solder RA Thru-Hole 4 Terminal 1 Port USB 2.0 Tray; NexarPartId: 942133; Number of Contacts: 4; Connector Type: Receptacle, USB; Gender: Receptacle; USB Standard: USB 2.0; Current Rating: 1.5A; Max Voltage Rating (AC): 30V; Number of Ports: 1; Lead Pitch: 2.5mm; Depth: 17mm; Length: 12mm; Orientation: Right Angle; Max Operating Temperature: 50°C; Termination: Solder; Number of Circuits: 4; REACH SVHC: Unknown; Schedule B: 8536695050; RoHS: Compliant; Voltage Rating: 30V; Number of Rows: 2; Number of Positions: 4; Housing Material: Nylon; Contact Plating: Gold; Height: 11.25mm; Number of Terminals: 4; Min Operating Temperature: 0°C; Mount: Through Hole; Pitch: 2.5mm; Radiation Hardening: No; Contact Material: Bronze, Gold, Nickel; Color: White
LS1 = CMP-06203-000001-2: AUDIO PIEZO TRANSDUCER 3-15V TH; Self Resonant Frequency: 3.6kHz; Voltage Rating (DC): 15V; Min Supply Voltage: 3V; Operating Supply Current: 16mA; Voltage Rating: 12V; Max Frequency: 4.1kHz; Washable: No; REACH SVHC: No SVHC; Packaging: Bulk; Frequency: 3.6kHz; Max Operating Temperature: 70°C; Max Supply Voltage: 15V; Max Supply Voltage (DC): 15V; Diameter: 24.3mm; Lead Free: Lead Free; Radiation Hardening: No; Nominal Supply Current: 16mA; Height: 9.7mm; Mount: Flush; Nominal Supply Voltage (DC): 12V; Min Operating Temperature: -20°C; Termination: PC Pins; Length: 24.3mm; Package Quantity: 650; Min Supply Voltage (DC): 3V; Max Supply Current: 16mA
Q7 = CMP-32901-000039-1: MOSFET N-CH 100V 17A D2PAK; Manufacturer: Infineon; Reverse Recovery Time: 93ns; Turn On Delay Time: 9.2ns; Number Of Channels: 1; Gate Charge At Vgs: 37nC @ 10V; Max Junction Temp: +175°C; Drain To Source Resistance: 90mΩ; Pulse Drain Current: 60A; Max Forward Diode Voltage: 1.3V; Threshold Vgs Min: 2V; Threshold Vgs Max: 4V; Depletion Mode: False; Rthja Max: 40°C/W; Reverse Recovery Charge: 320nC; Turn Off Delay Time: 35ns; Gate To Source Voltage: 20V; Power Dissipation: 3.8W; Standoff Height: 0mm; Input Capacitace At Vds: 920pF @ 25V; Height: 5.084mm; RoHS: TRUE; Device Class L2: Transistors; Lead Free: Yes; Automotive: No; Category: Trans; Footprint Url: https://www.infineon.com/cms/en/product/packages/PG-TO263/PG-TO263-3-901/; ComponentLink2Description: Datasheet; Temperature Range Low: -55°C; Drain To Source Voltage: 100V; Temperature: -55°C to +175°C; Device Class L1: Discrete Semiconductors; Number Of N Channels: 1; Continuous Drain Current: 17A; Temperature Range High: +175°C; Digikey Description: MOSFET N-CH 100V 17A D2PAK; Drain To Source Breakdown Voltage: 100V; ComponentLink2URL: https://www.infineon.com/dgdl/irf530nspbf.pdf?fileId=5546d462533600a4015355e38eb4199c; Manufacturer Part Number: IRF530NSTRLPBF; Device Class L3: MOSFETs; Octopart: https://octopart.com/irf530nstrlpbf-infineon-65873402; Package: PG-TO263-3
BT1 = 1066: Package: None; Price: None; Value: *; MP: 1066; Availability: Unavailable

## Sheet STM32.SchDoc
size A; SheetNumber: 8; SheetTotal: 10
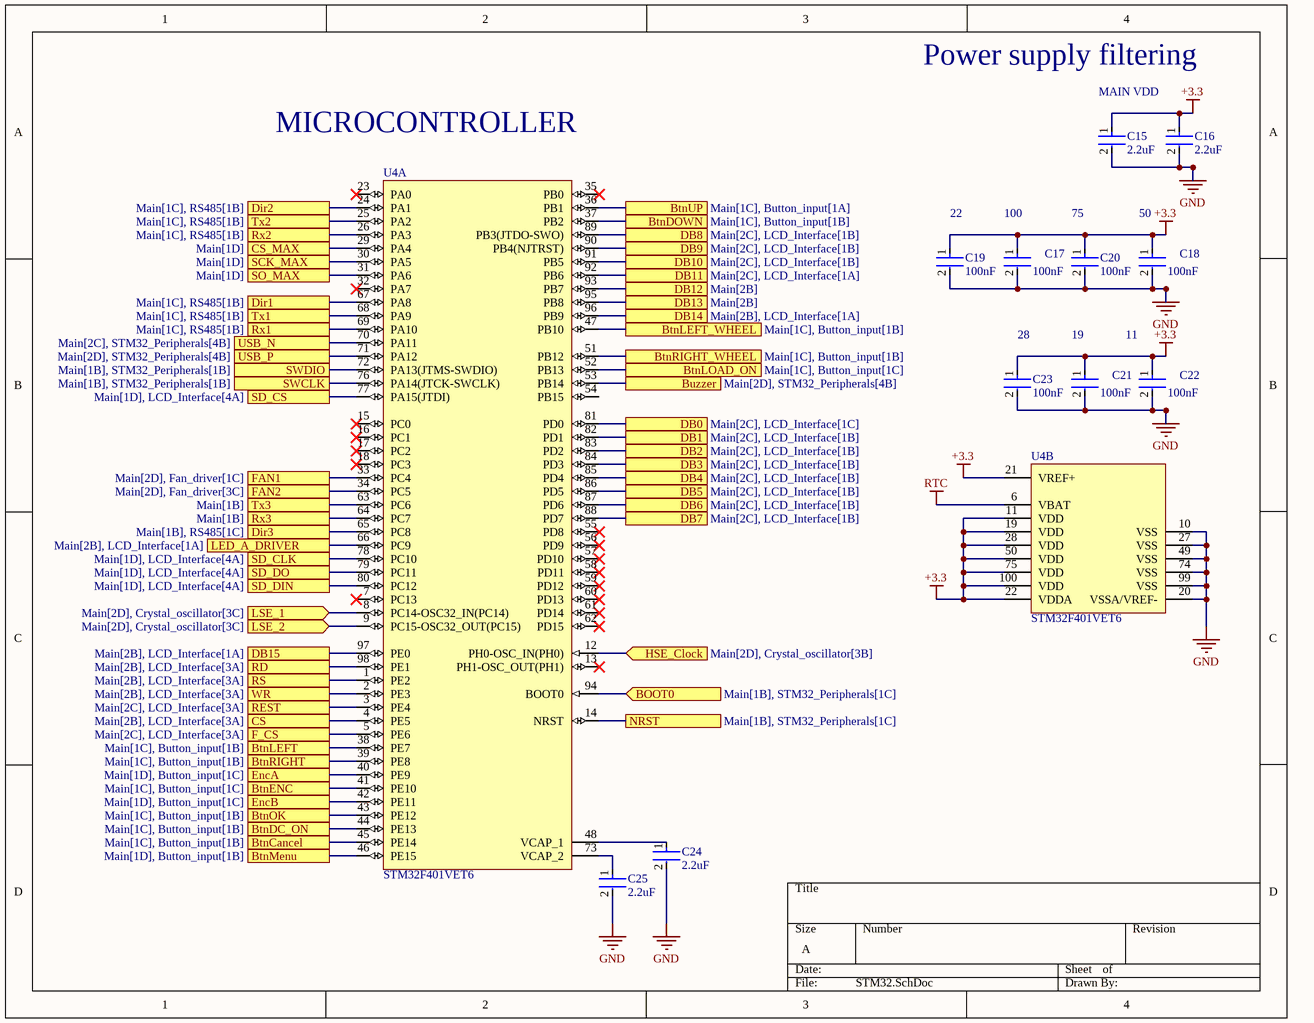
[diagram p8: STM32.SchDoc]

### Parts
C15  2.2uF  [FP-0805-L_2_01_0_2-W_1_25-IPC_B]
C16  2.2uF  [FP-0805-L_2_01_0_2-W_1_25-IPC_B]
C17  100nF  [FP-CGA3E-0_3-0_1-IPC_A]
C18  100nF  [FP-CGA3E-0_3-0_1-IPC_A]
C19  100nF  [FP-CGA3E-0_3-0_1-IPC_A]
C20  100nF  [FP-CGA3E-0_3-0_1-IPC_A]
C21  100nF  [FP-CGA3E-0_3-0_1-IPC_A]
C22  100nF  [FP-CGA3E-0_3-0_1-IPC_A]
C23  100nF  [FP-CGA3E-0_3-0_1-IPC_A]
C24  2.2uF  [FP-0805-L_2_01_0_2-W_1_25-IPC_B]
C25  2.2uF  [FP-0805-L_2_01_0_2-W_1_25-IPC_B]
U4  STM32F401VET6  [STM-LQFP100_L]  (parts A,B of 2)

### Ports
BOOT0 (in, see Main[1B], STM32_Peripherals[1C]), BtnCancel (see Main[1C], Button_input[1B]), BtnDC_ON (see Main[1C], Button_input[1B]), BtnDOWN (see Main[1C], Button_input[1B]), BtnENC (see Main[1C], Button_input[1C]), BtnLEFT (see Main[1C], Button_input[1B]), BtnLEFT_WHEEL (see Main[1C], Button_input[1B]), BtnLOAD_ON (see Main[1C], Button_input[1C]), BtnMenu (see Main[1D], Button_input[1B]), BtnOK (see Main[1C], Button_input[1B]), BtnRIGHT (see Main[1C], Button_input[1B]), BtnRIGHT_WHEEL (see Main[1C], Button_input[1B]), BtnUP (see Main[1C], Button_input[1A]), Buzzer (see Main[2D], STM32_Peripherals[4B]), CS (see Main[2B], LCD_Interface[3A]), CS_MAX (see Main[1D]), DB0 (see Main[2C], LCD_Interface[1C]), DB1 (see Main[2C], LCD_Interface[1B]), DB2 (see Main[2C], LCD_Interface[1B]), DB3 (see Main[2C], LCD_Interface[1B]), DB4 (see Main[2C], LCD_Interface[1B]), DB5 (see Main[2C], LCD_Interface[1B]), DB6 (see Main[2C], LCD_Interface[1B]), DB7 (see Main[2C], LCD_Interface[1B]), DB8 (see Main[2C], LCD_Interface[1B]), DB9 (see Main[2C], LCD_Interface[1B]), DB10 (see Main[2C], LCD_Interface[1B]), DB11 (see Main[2C], LCD_Interface[1A]), DB12 (see Main[2B]), DB13 (see Main[2B]), DB14 (see Main[2B], LCD_Interface[1A]), DB15 (see Main[2B], LCD_Interface[1A]), Dir1 (see Main[1C], RS485[1B]), Dir2 (see Main[1C], RS485[1B]), Dir3 (see Main[1B], RS485[1C]), EncA (see Main[1D], Button_input[1C]), EncB (see Main[1D], Button_input[1C]), F_CS (see Main[2C], LCD_Interface[3A]), FAN1 (see Main[2D], Fan_driver[1C]), FAN2 (see Main[2D], Fan_driver[3C]), HSE_Clock (in, see Main[2D], Crystal_oscillator[3B]), LED_A_DRIVER (see Main[2B], LCD_Interface[1A]), LSE_1 (in, see Main[2D], Crystal_oscillator[3C]), LSE_2 (in, see Main[2D], Crystal_oscillator[3C]), NRST (see Main[1B], STM32_Peripherals[1C]), RD (see Main[2B], LCD_Interface[3A]), REST (see Main[2C], LCD_Interface[3A]), RS (see Main[2B], LCD_Interface[3A]), Rx1 (see Main[1C], RS485[1B]), Rx2 (see Main[1C], RS485[1B]), Rx3 (see Main[1B]), SCK_MAX (see Main[1D]), SD_CLK (see Main[1D], LCD_Interface[4A]), SD_CS (see Main[1D], LCD_Interface[4A]), SD_DIN (see Main[1D], LCD_Interface[4A]), SD_DO (see Main[1D], LCD_Interface[4A]), SO_MAX (see Main[1D]), SWCLK (see Main[1B], STM32_Peripherals[1B]), SWDIO (see Main[1B], STM32_Peripherals[1B]), Tx1 (see Main[1C], RS485[1B]), Tx2 (see Main[1C], RS485[1B]), Tx3 (see Main[1B]), USB_N (see Main[2C], STM32_Peripherals[4B]), USB_P (see Main[2D], STM32_Peripherals[4B]), WR (see Main[2B], LCD_Interface[3A])

### Nets
+3.3: C15.1 C16.1 C17.1 C18.1 C19.1 C20.1 C21.1 C22.1 C23.1 U4.11(VDD) U4.19(VDD) U4.21(VREF+) U4.22(VDDA) U4.28(VDD) U4.50(VDD) U4.75(VDD) U4.100(VDD)
GND: C15.2 C16.2 C17.2 C18.2 C19.2 C20.2 C21.2 C22.2 C23.2 C24.2 C25.2 U4.10(VSS) U4.20(VSSA/VREF-) U4.27(VSS) U4.49(VSS) U4.74(VSS) U4.99(VSS)
RTC: U4.6(VBAT)
BOOT0: U4.94(BOOT0) ; port BOOT0
BtnCancel: U4.45(PE14) ; port BtnCancel
BtnDC_ON: U4.44(PE13) ; port BtnDC_ON
BtnDOWN: U4.37(PB2) ; port BtnDOWN
BtnENC: U4.41(PE10) ; port BtnENC
BtnLEFT: U4.38(PE7) ; port BtnLEFT
BtnLEFT_WHEEL: U4.47(PB10) ; port BtnLEFT_WHEEL
BtnLOAD_ON: U4.52(PB13) ; port BtnLOAD_ON
BtnMenu: U4.46(PE15) ; port BtnMenu
BtnOK: U4.43(PE12) ; port BtnOK
BtnRIGHT: U4.39(PE8) ; port BtnRIGHT
BtnRIGHT_WHEEL: U4.51(PB12) ; port BtnRIGHT_WHEEL
BtnUP: U4.36(PB1) ; port BtnUP
Buzzer: U4.53(PB14) ; port Buzzer
CS: U4.4(PE5) ; port CS
CS_MAX: U4.29(PA4) ; port CS_MAX
DB0: U4.81(PD0) ; port DB0
DB1: U4.82(PD1) ; port DB1
DB2: U4.83(PD2) ; port DB2
DB3: U4.84(PD3) ; port DB3
DB4: U4.85(PD4) ; port DB4
DB5: U4.86(PD5) ; port DB5
DB6: U4.87(PD6) ; port DB6
DB7: U4.88(PD7) ; port DB7
DB8: U4.89(PB3(JTDO-SWO)) ; port DB8
DB9: U4.90(PB4(NJTRST)) ; port DB9
DB10: U4.91(PB5) ; port DB10
DB11: U4.92(PB6) ; port DB11
DB12: U4.95(PB8) ; port DB13
DB13: U4.93(PB7) ; port DB12
DB14: U4.96(PB9) ; port DB14
DB15: U4.97(PE0) ; port DB15
Dir1: U4.67(PA8) ; port Dir1
Dir2: U4.24(PA1) ; port Dir2
Dir3: U4.65(PC8) ; port Dir3
EncA: U4.40(PE9) ; port EncA
EncB: U4.42(PE11) ; port EncB
F_CS: U4.5(PE6) ; port F_CS
FAN1: U4.33(PC4) ; port FAN1
FAN2: U4.34(PC5) ; port FAN2
HSE_Clock: U4.12(PH0-OSC_IN(PH0)) ; port HSE_Clock
LED_A_DRIVER: U4.66(PC9) ; port LED_A_DRIVER
LSE_1: U4.8(PC14-OSC32_IN(PC14)) ; port LSE_1
LSE_2: U4.9(PC15-OSC32_OUT(PC15)) ; port LSE_2
NRST: U4.14(NRST) ; port NRST
RD: U4.98(PE1) ; port RD
REST: U4.3(PE4) ; port REST
RS: U4.1(PE2) ; port RS
Rx1: U4.69(PA10) ; port Rx1
Rx2: U4.26(PA3) ; port Rx2
Rx3: U4.63(PC6) ; port Tx3
SCK_MAX: U4.30(PA5) ; port SCK_MAX
SD_CLK: U4.78(PC10) ; port SD_CLK
SD_CS: U4.77(PA15(JTDI)) ; port SD_CS
SD_DIN: U4.80(PC12) ; port SD_DIN
SD_DO: U4.79(PC11) ; port SD_DO
SO_MAX: U4.31(PA6) ; port SO_MAX
SWCLK: U4.76(PA14(JTCK-SWCLK)) ; port SWCLK
SWDIO: U4.72(PA13(JTMS-SWDIO)) ; port SWDIO
Tx1: U4.68(PA9) ; port Tx1
Tx2: U4.25(PA2) ; port Tx2
Tx3: U4.64(PC7) ; port Rx3
USB_N: U4.70(PA11) ; port USB_N
USB_P: U4.71(PA12) ; port USB_P
WR: U4.2(PE3) ; port WR
NetC24_1: C24.1 U4.48(VCAP_1)
NetC25_1: C25.1 U4.73(VCAP_2)

Not connected (* = marked no-connect by the designer): U4 7(PC13)* 13(PH1-OSC_OUT(PH1))* 15(PC0)* 16(PC1)* 17(PC2)* 18(PC3)* 23(PA0)* 32(PA7)* 35(PB0)* 54(PB15) 55(PD8)* 56(PD9)* 57(PD10)* 58(PD11)* 59(PD12)* 60(PD13)* 61(PD14)* 62(PD15)*

### Notes on the sheet
- Power supply filtering
- MAIN VDD
- MICROCONTROLLER
- (near C19) 22
- (near C17) 100
- (near C20) 75
- (near C18) 50
- (near C23) 28
- (near C21) 19
- 11

### Library data of the parts
C15 C16 C24 C25 = CMP-2007-04174-2: as C10 on sheet Crystal_oscillator; Packaging: Tape and Reel; Min Operating Temperature: -55°C; Dielectric Material: Ceramic; Height: 1.4mm; Voltage Rating: 100V; Termination: SMD/SMT; Case Code (Imperial): 0805; Case Code (Metric): 2012; Case/Package: 0805; Construction: Flat; Radiation Hardening: No; Series: -; Dielectric: X7R; Package Quantity: 2000; Mount: Surface Mount; Contact Plating: Tin; Voltage: 100V; Lead Free: Lead Free; Depth: 1.25mm; RoHS Compliant: Yes; Number of Pins: 2; Max Operating Temperature: 125°C; Length: 2.01mm; Voltage Rating (DC): 100V; Thickness: 0.055inch; REACH SVHC: No SVHC; Width: 0.049inch; Tolerance: 10%
C17-C23 = CMP-2000-07546-2: Cap Ceramic 100nF 50V X7R 10% Pad SMD 0603 +125°C Automotive T/R; Weight: 7.1E-05oz; Composition: Ceramic; Max Operating Temperature: 125°C; Termination: SMD/SMT; Dielectric: X7R; Length: 1.6mm; Package Quantity: 1; REACH SVHC: No SVHC; Lead Free: Lead Free; Case Code (Metric): 1608; Min Operating Temperature: -55°C; Packaging: Tape and Reel; Tolerance: 10%; Voltage Rating: 50V; Case Code (Imperial): 0603; Capacitance: 100nF; Case/Package: 0603; Voltage Rating (DC): 50V; Depth: 0.8mm; Radiation Hardening: No; Ratings: AEC-Q200; Mount: Surface Mount; Voltage: 50V; Thickness: 0.035inch; Width: 0.8mm; Height: 0.8mm
U4 = CMP-0243-00155-1: ARM Cortex-M4 32-bit MCU+FPU, 512 KB Flash, 96 KB Internal RAM, 81 I/Os, 100-Pin LQFP, -40 to 85 degC, Tray; Internal RAM Size (kB): 96; Operating Frequency(F) (Processor speed) (MHz): 84; FLASH Size (Prog) (kB): 512; Supply Voltage(Vcc) min (V): 1.7; I/Os (High Current): 81; Mounting Technology: Surface Mount; DatasheetVersion: Rev. 3; Packing: Tray; ComponentLink2Description: Datasheet; ComponentLink1URL: http://www.st.com/; ComponentLink1Description: Manufacturer URL; Core: ARM Cortex-M4; Package Reference: 100-Pin Low Profile Quad Flat Package, Body 14 x 14 mm, Pitch 0.5 mm; ComponentLink2URL: http://www.st.com/st-web-ui/static/active/en/resource/technical/document/datasheet/DM00102166.pdf; Package Description: LQFP100